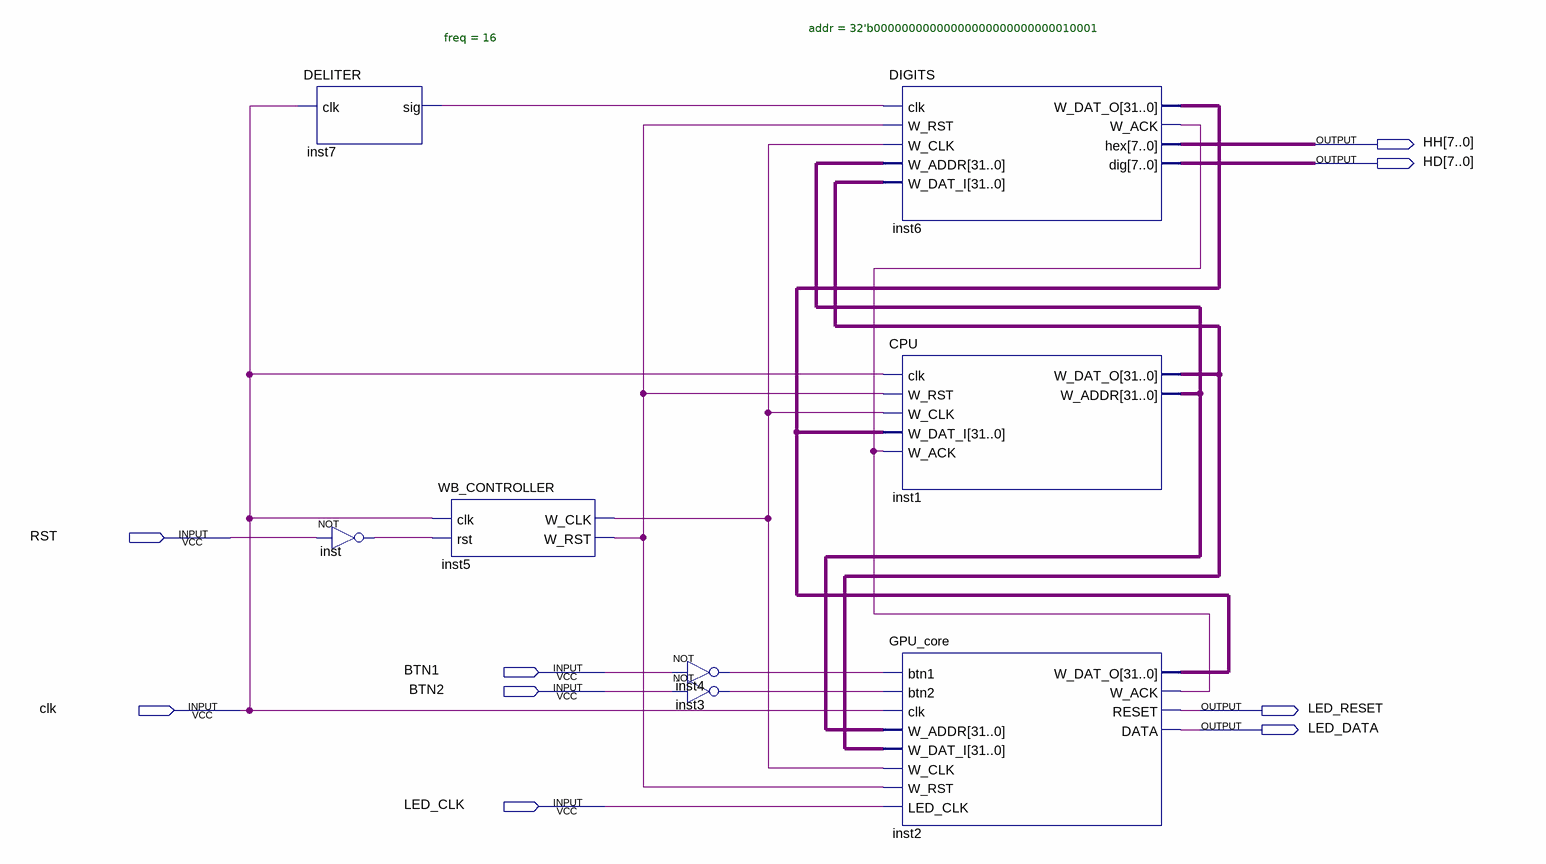
[diagram p0: schematic sheet]
// Quartus schematic SoC.bdf as structural Verilog: 8 symbols, 9 pins
module SoC (
  input  RST,
  input  BTN1,
  input  BTN2,
  input  clk,
  input  LED_CLK,
  output [7:0] HH,
  output [7:0] HD,
  output LED_RESET,
  output LED_DATA
);

  wire inst3_out, inst4_out, inst5_w_clk, inst5_w_rst, inst6_w_ack, inst7_sig, inst_out;
  wire [31:0] inst1_w_addr, inst1_w_dat_o, inst6_w_dat_o;

  DELITER #(.freq(16)) inst7 (.clk(clk), .sig(inst7_sig));
  not inst (inst_out, RST);
  WB_CONTROLLER inst5 (.clk(clk), .rst(inst_out), .W_CLK(inst5_w_clk), .W_RST(inst5_w_rst));
  not inst4 (inst4_out, BTN1);
  not inst3 (inst3_out, BTN2);
  DIGITS #(.addr(32'b00000000000000000000000000010001)) inst6 (
    .clk(inst7_sig), .W_RST(inst5_w_rst), .W_CLK(inst5_w_clk), .W_ADDR(inst1_w_addr),
    .W_DAT_I(inst1_w_dat_o), .W_DAT_O(inst6_w_dat_o), .W_ACK(inst6_w_ack), .hex(HH), .dig(HD));
  CPU inst1 (
    .clk(clk), .W_RST(inst5_w_rst), .W_CLK(inst5_w_clk), .W_DAT_I(inst6_w_dat_o), .W_ACK(inst6_w_ack),
    .W_DAT_O(inst1_w_dat_o), .W_ADDR(inst1_w_addr));
  GPU_core inst2 (
    .btn1(inst4_out), .btn2(inst3_out), .clk(clk), .W_ADDR(inst1_w_addr), .W_DAT_I(inst1_w_dat_o),
    .W_CLK(inst5_w_clk), .W_RST(inst5_w_rst), .LED_CLK(LED_CLK), .W_DAT_O(inst6_w_dat_o),
    .W_ACK(inst6_w_ack), .RESET(LED_RESET), .DATA(LED_DATA));
endmodule
